# Altium project Wireless_Security_Detector.PrjPcb (part 1 of 2)
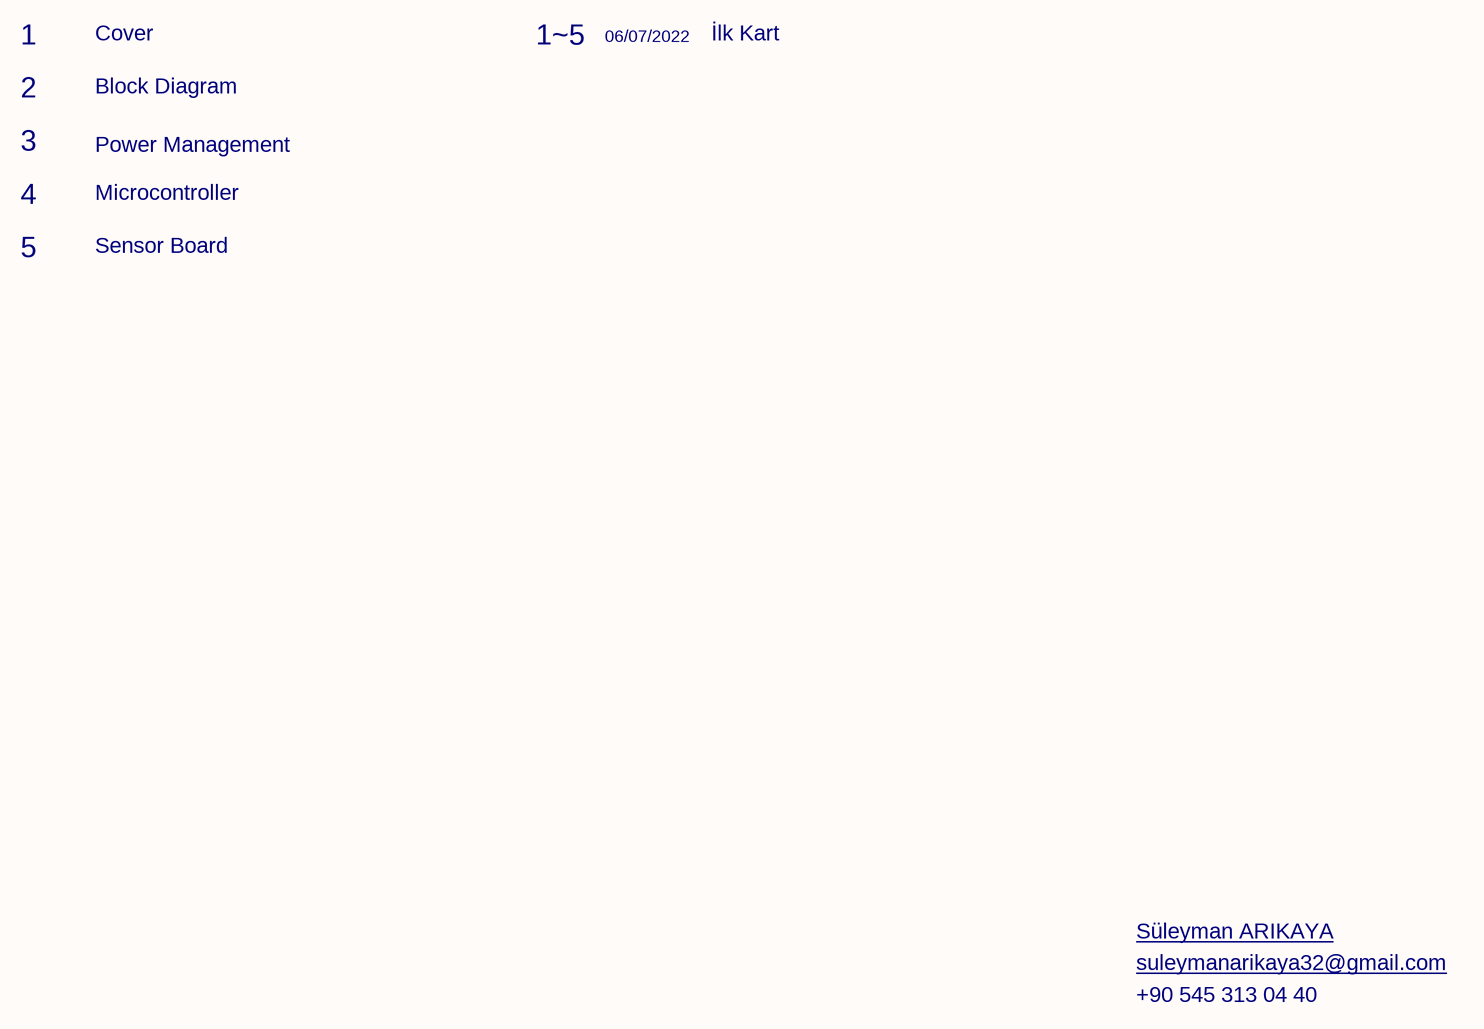
[diagram p0: Cover.SchDoc]
4 sheets, 85 parts. Net scope: flat (ports and power ports of the same name join across sheets).
Board file: Wireless_Detector.PcbDoc
Sheets:
  Cover.SchDoc
  Block Diagram.SchDoc
  Microcontroller.SchDoc
  Sensor_Board.SchDoc

## Sheet Cover.SchDoc
size 420 x 297 mm; DrawnBy: Süleyman ARIKAYA; Revision: AA; SheetNumber: 1; SheetTotal: 5

### Notes on the sheet
- 1
- Cover
- Block Diagram
- 1~5
- 06/07/2022
- İlk Kart
- 2
- 3
- Power Management
- 4
- Microcontroller
- 5
- Sensor Board
- Süleyman ARIKAYA <suleymanarikaya32@gmail.com>
- suleymanarikaya32@gmail.com
- +90 545 313 04 40
- İÇİNDEKİLER / CONTEXT
- REVİZYON / REVISION
- ÜRETİM NOTLARI / PRODUCTION NOTES
- Sayfa No
- Page No
- Açıklama / Description
- Tarih
- Date
- Kart Özellikleri
- Boartd Features
- Üretim Çıktıları
- Gerber Files
- Ekler
- Attachments
- İLETİŞİM / CONTACT
- TITLE:
- PROJECT:
- Size:
- A3
- Date:
- Rev:
- Drawn By:
- Süleyman ARIKAYA
- Sheet:
- of

## Sheet Block Diagram.SchDoc
size 420 x 297 mm; DrawnBy: Süleyman ARIKAYA; Revision: AA; SheetNumber: 2; SheetTotal: 5
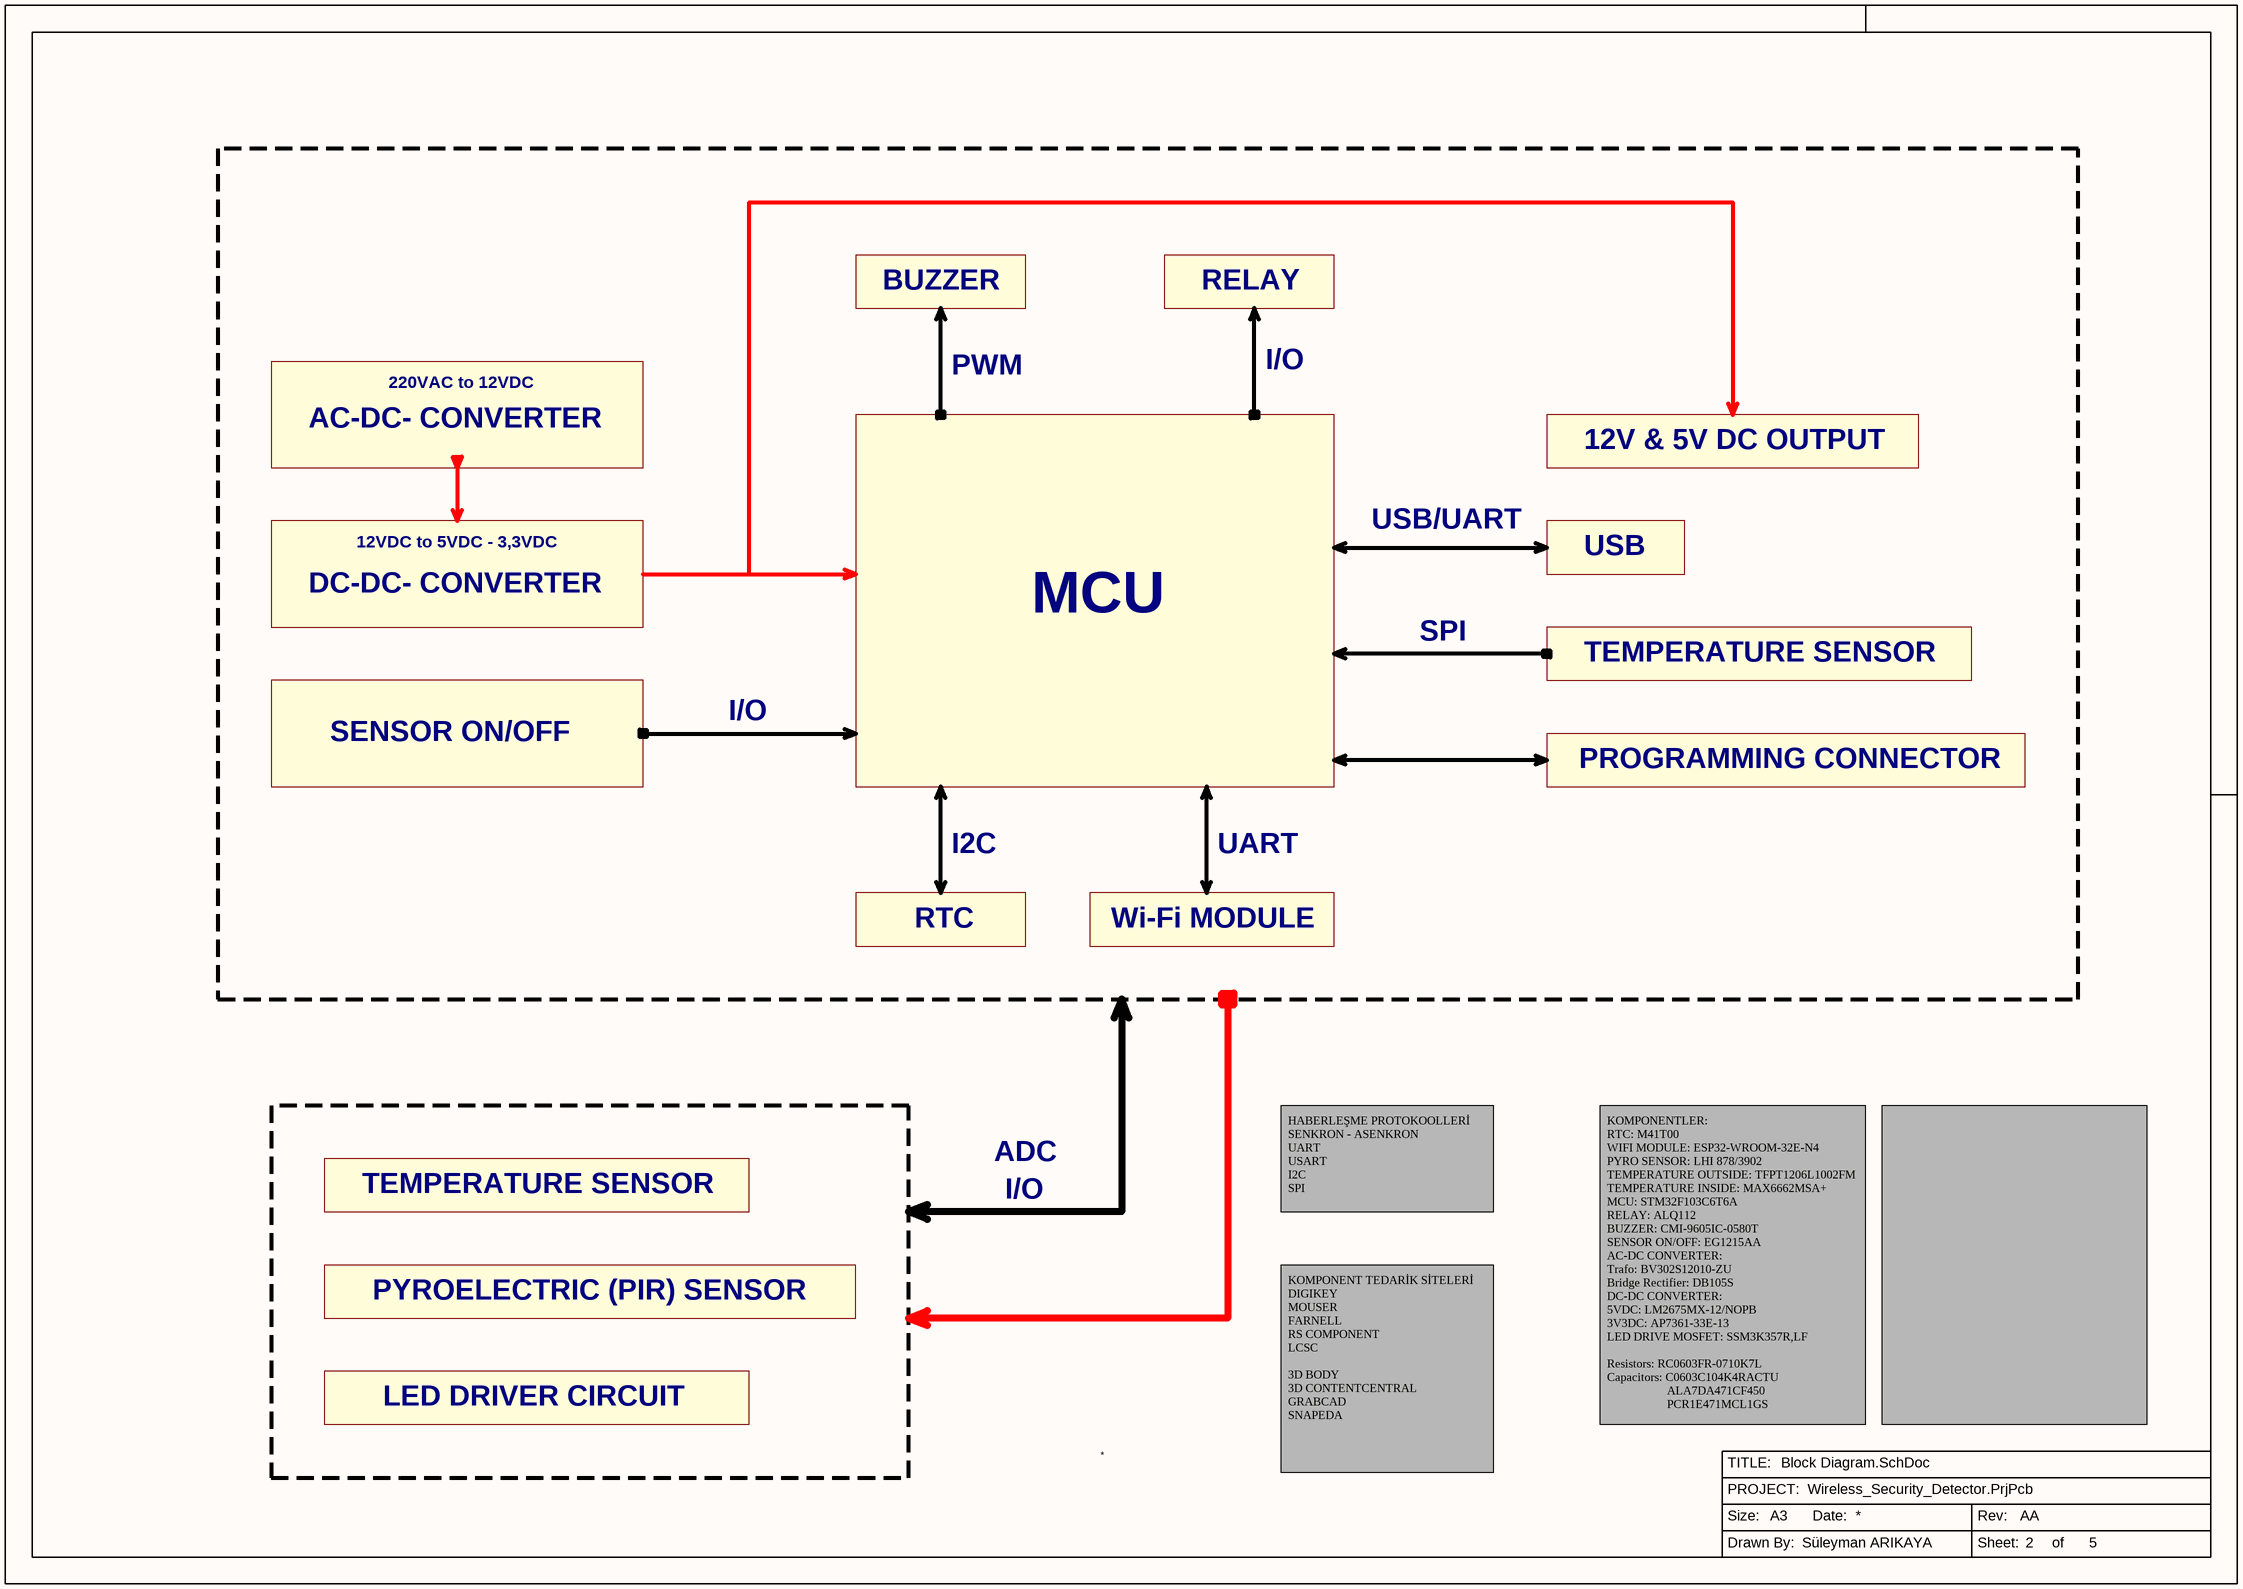
[diagram p1: Block Diagram.SchDoc]

### Notes on the sheet
- BUZZER
- RELAY
- 220VAC to 12VDC
- PWM
- I/O
- AC-DC- CONVERTER
- 12V & 5V DC OUTPUT
- USB/UART
- DC-DC- CONVERTER
- 12VDC to 5VDC - 3,3VDC
- USB
- MCU
- SPI
- TEMPERATURE SENSOR
- SENSOR ON/OFF
- PROGRAMMING CONNECTOR
- I2C
- UART
- RTC
- Wi-Fi MODULE
- ADC
- HABERLEŞME PROTOKOOLLERİ
  SENKRON - ASENKRON
  UART
  USART
  I2C
  SPI
- PYROELECTRIC (PIR) SENSOR
- LED DRIVER CIRCUIT
- KOMPONENT TEDARİK SİTELERİ
  DIGIKEY
  MOUSER
  FARNELL
  RS COMPONENT
  LCSC
  3D BODY
  3D CONTENTCENTRAL
  GRABCAD
  SNAPEDA
- KOMPONENTLER:
  RTC: M41T00
  WIFI MODULE: ESP32-WROOM-32E-N4
  PYRO SENSOR: LHI 878/3902
  TEMPERATURE OUTSIDE: TFPT1206L1002FM
  TEMPERATURE INSIDE: MAX6662MSA+
  MCU: STM32F103C6T6A
  RELAY: ALQ112
  BUZZER: CMI-9605IC-0580T
  SENSOR ON/OFF: EG1215AA
  AC-DC CONVERTER:
  Trafo: BV302S12010-ZU
  Bridge Rectifier: DB105S
  DC-DC CONVERTER:
  5VDC: LM2675MX-12/NOPB
  3V3DC: AP7361-33E-13
  LED DRIVE MOSFET: SSM3K357R,LF
  Resistors: RC0603FR-0710K7L
  Capacitors: C0603C104K4RACTU
  ALA7DA471CF450
  PCR1E471MCL1GS
- TITLE:
- PROJECT:
- Size:
- A3
- Date:
- Rev:
- Drawn By:
- Süleyman ARIKAYA
- Sheet:
- of

## Sheet Microcontroller.SchDoc
size 420 x 297 mm; DrawnBy: Süleyman ARIKAYA; Revision: AA; SheetNumber: 4; SheetTotal: 5
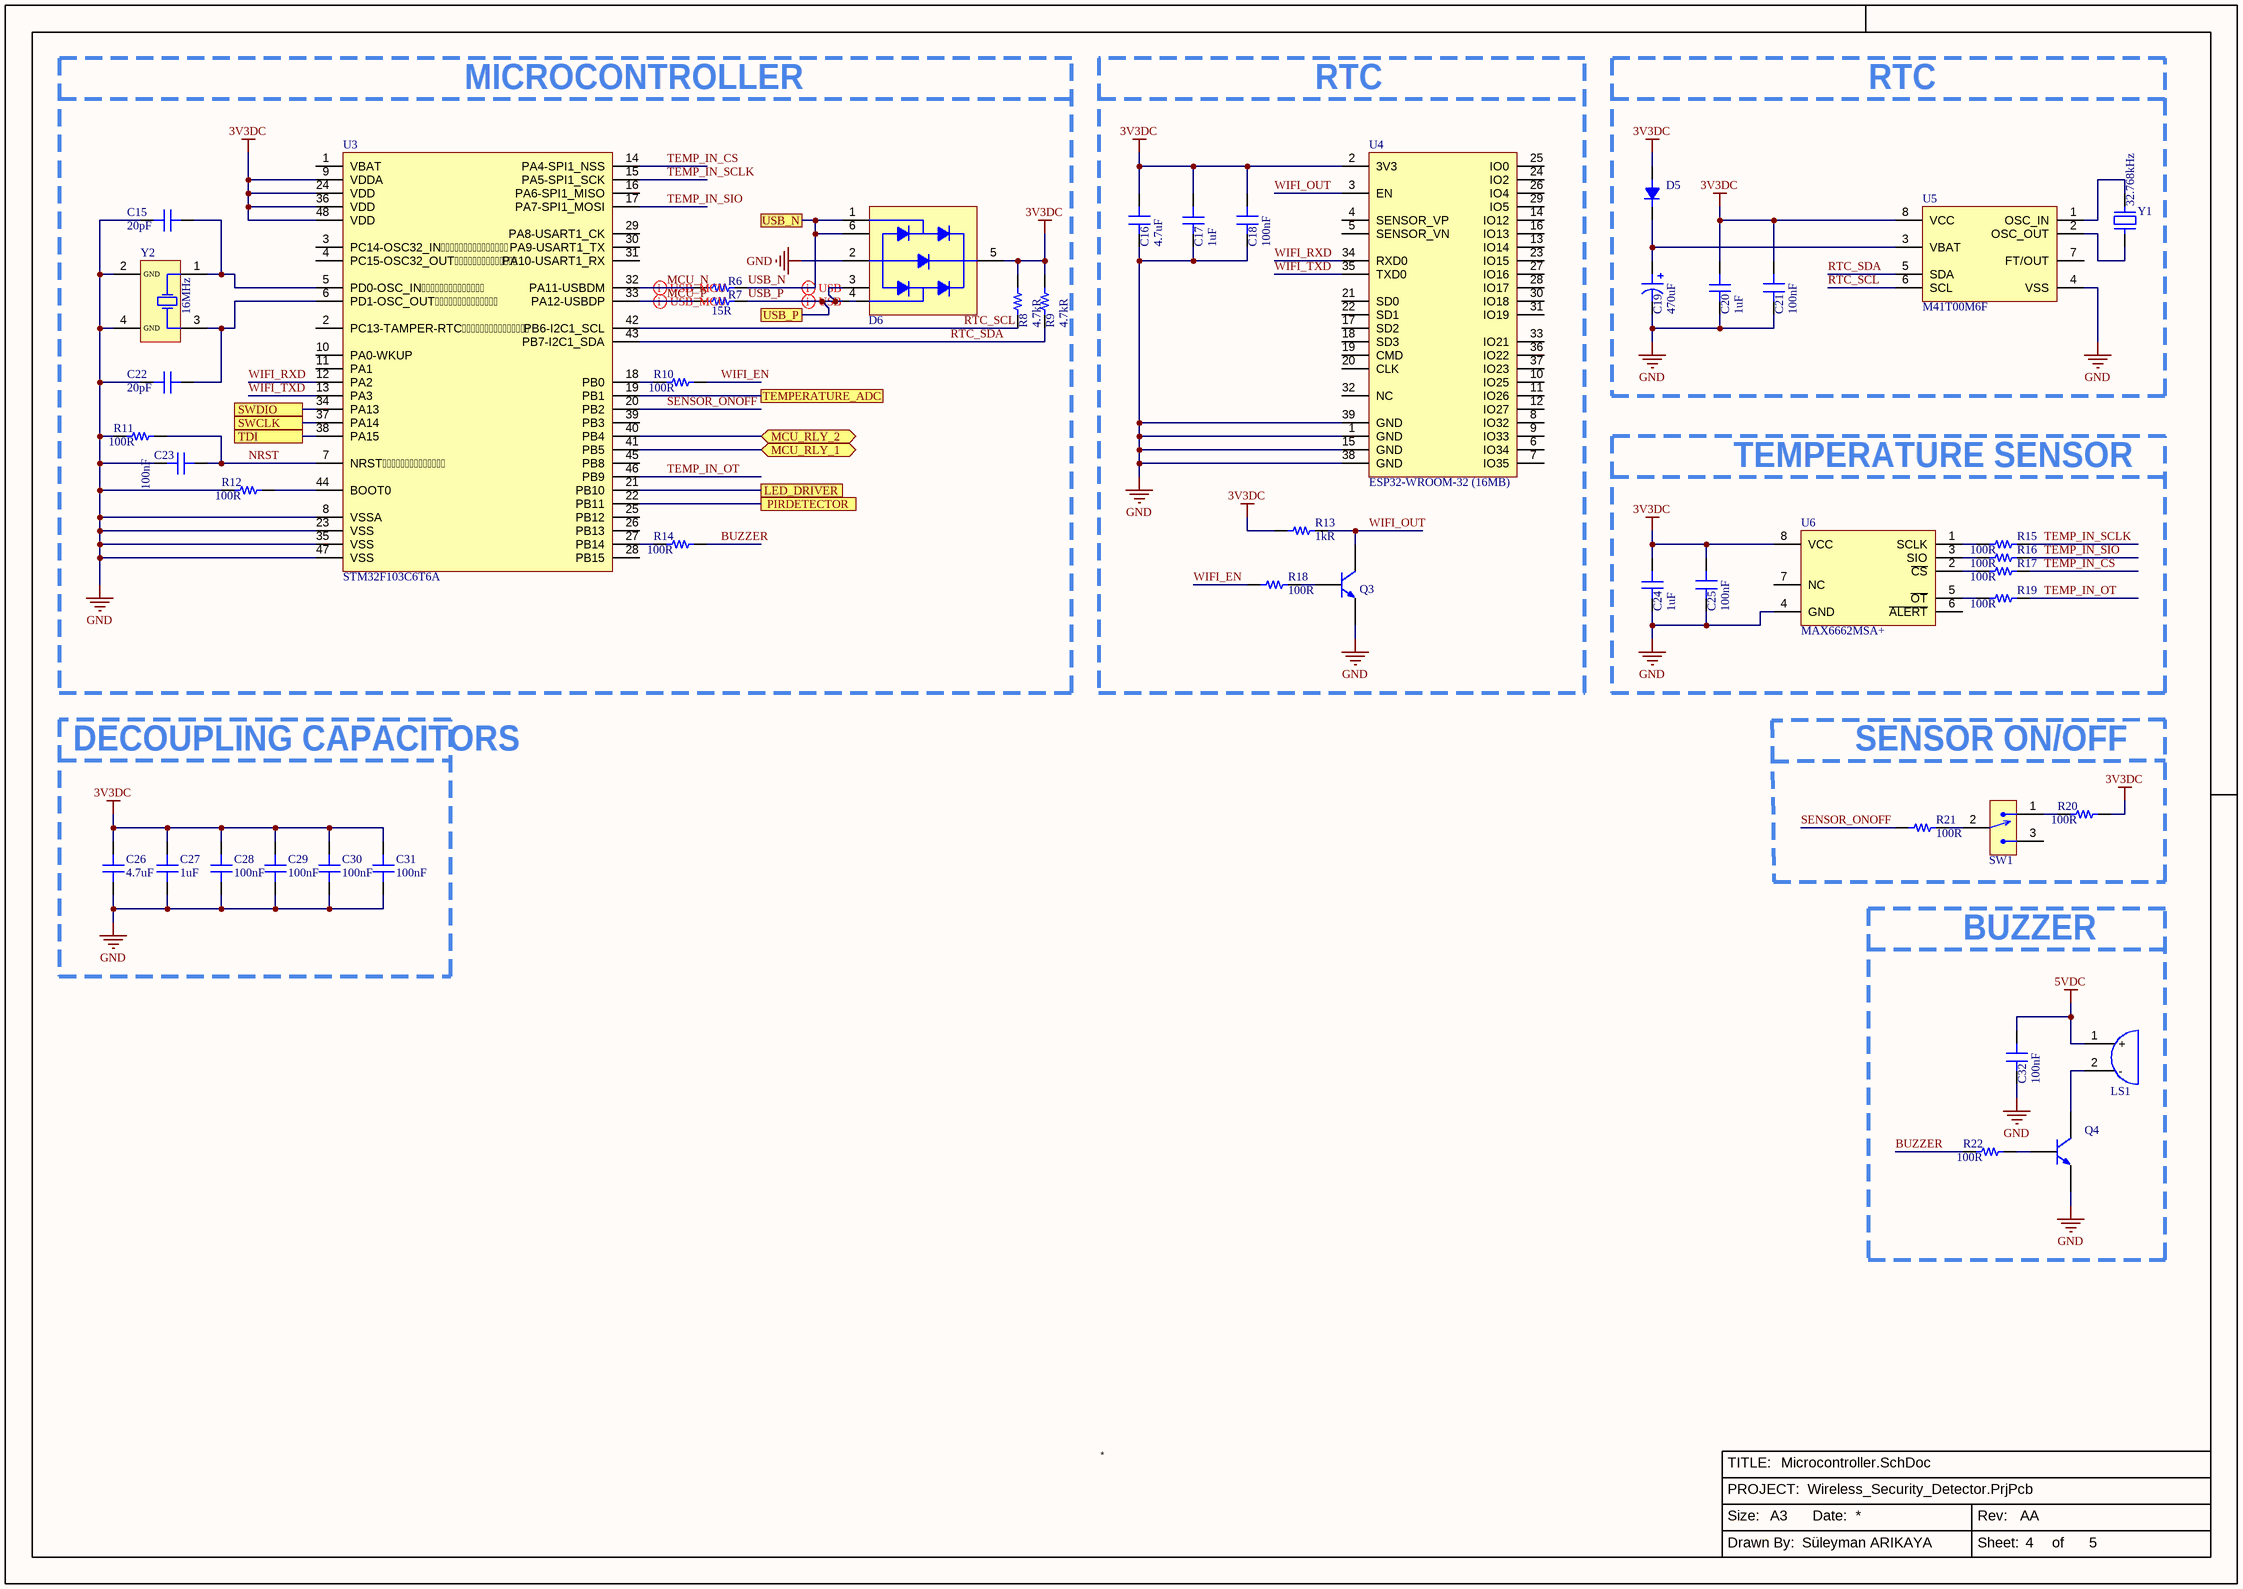
[diagram p2: Microcontroller.SchDoc]

### Parts
C15  Capacitance: 20pF  [C0603_CER]  (hidden comment: CL10C200JB8NNNC)
C16  Capacitance: 4.7uF  [C0805_CER]  (hidden comment: CL21A475KAQNNNE)
C17  Capacitance: 1uF  [C0805_CER]  (hidden comment: CL21B105KBFNNNE)
C18  Capacitance: 100nF  [C0805_CER]  (hidden comment: CL21B104KBCNNNC)
C19  Capacitance: 470uF  [CAP_RADIAL_D10_P5]  (hidden comment: ESH477M050AH4AA)
C20  Capacitance: 1uF  [C0805_CER]  (hidden comment: CL21B105KBFNNNE)
C21  Capacitance: 100nF  [C0805_CER]  (hidden comment: CL21B104KBCNNNC)
C22  Capacitance: 20pF  [C0603_CER]  (hidden comment: CL10C200JB8NNNC)
C23  Capacitance: 100nF  [C0603_CER]  (hidden comment: C0603C104K5RAC7411)
C24  Capacitance: 1uF  [C0805_CER]  (hidden comment: CL21B105KBFNNNE)
C25  Capacitance: 100nF  [C0805_CER]  (hidden comment: CL21B104KBCNNNC)
C26  Capacitance: 4.7uF  [C0805_CER]  (hidden comment: CL21A475KAQNNNE)
C27  Capacitance: 1uF  [C0805_CER]  (hidden comment: CL21B105KBFNNNE)
C28  Capacitance: 100nF  [C0603_CER]  (hidden comment: C0603C104K5RAC7411)
C29  Capacitance: 100nF  [C0603_CER]  (hidden comment: C0603C104K5RAC7411)
C30  Capacitance: 100nF  [C0603_CER]  (hidden comment: C0603C104K5RAC7411)
C31  Capacitance: 100nF  [C0603_CER]  (hidden comment: C0603C104K5RAC7411)
C32  Capacitance: 100nF  [C0805_CER]  (hidden comment: CL21B104KBCNNNC)
D5  1N4148WS  [SOD-323F]  (value not drawn)
D6  USBLC6-2SC6  [SOT23-6L]  (value not drawn)
LS1  CMI-9605IC-0580T  [CMI-9605IC-0580T]  (value not drawn)
Q3  MMBT3904-7-F  [SOT-23F]  (value not drawn)
Q4  MMBT3904-7-F  [SOT-23F]  (value not drawn)
R6  RC0603JR-0715RL  [R0603]  (value not drawn)
R7  Resistance: 15R  [R0603]  (hidden comment: RC0603JR-0715RL)
R8  Resistance: 4.7kR  [R0603]  (hidden comment: RC0603JR-074K7L)
R9  Resistance: 4.7kR  [R0603]  (hidden comment: RC0603JR-074K7L)
R10  Resistance: 100R  [R0603]  (hidden comment: RC0603JR-07100RL)
R11  Resistance: 100R  [R0603]  (hidden comment: RC0603JR-07100RL)
R12  Resistance: 100R  [R0603]  (hidden comment: RC0603JR-07100RL)
R13  Resistance: 1kR  [R0603]  (hidden comment: RC0603FR-071KL)
R14  Resistance: 100R  [R0603]  (hidden comment: RC0603JR-07100RL)
R15  Resistance: 100R  [R0603]  (hidden comment: RC0603JR-07100RL)
R16  Resistance: 100R  [R0603]  (hidden comment: RC0603JR-07100RL)
R17  Resistance: 100R  [R0603]  (hidden comment: RC0603JR-07100RL)
R18  Resistance: 100R  [R0603]  (hidden comment: RC0603JR-07100RL)
R19  Resistance: 100R  [R0603]  (hidden comment: RC0603JR-07100RL)
R20  Resistance: 100R  [R0603]  (hidden comment: RC0603JR-07100RL)
R21  Resistance: 100R  [R0603]  (hidden comment: RC0603JR-07100RL)
R22  Resistance: 100R  [R0603]  (hidden comment: RC0603JR-07100RL)
SW1  EG1215AA  [EG1215AA]  (value not drawn)
U3  STM32F103C6T6A  [LQFP-48]
U4  ESP32-WROOM-32 (16MB)  [ESP32-WROOM-32]
U5  M41T00M6F  [SOIC8]
U6  MAX6662MSA+  [SOIC8]
Y1  Frequency: 32.768kHz  [ABS05]  (hidden comment: ABS05-32.768KHZ-T)
Y2  Frequency: 16MHz  [ECS CRYSTAL 16MHZ]  (hidden comment: ECS-160-20-30B-TR)

### Blocks framed on the sheet
MICROCONTROLLER: C15 C22 C23 D6 R6-R12 R14 U3 Y2
RTC: C16-C18 Q3 R13 R18 U4
RTC: C19-C21 D5 U5 Y1
TEMPERATURE SENSOR: C24 C25 R15-R17 R19 U6
DECOUPLING CAPACITORS: C26-C31
SENSOR ON/OFF: R20 R21 SW1
BUZZER: C32 LS1 Q4 R22

### Ports
LED_DRIVER, MCU_RLY_1 (bidir), MCU_RLY_2 (bidir), PIRDETECTOR, SWCLK, SWDIO, TDI, TEMPERATURE_ADC, USB_N, USB_P

### Nets
3V3DC: C16.2 C17.2 C18.2 C20.2 C21.2 C24.2 C25.2 C26.2 C27.2 C28.2 C29.2 C30.2 C31.2 D5.A D6.5(VBUS) R8.2 R9.1 R13.1 R20.2 U3.9(VDDA) U3.24(VDD) U3.36(VDD) U3.48(VDD) U4.2(3V3) U5.8(VCC) U6.8(VCC)
5VDC: C32.2 LS1.1(+)
GND: C15.1 C16.1 C17.1 C18.1 C19.2 C20.1 C21.1 C22.1 C23.1 C24.1 C25.1 C26.1 C27.1 C28.1 C29.1 C30.1 C31.1 C32.1 D6.2(GND) Q3.2(E) Q4.2(E) R11.1 R12.1 U3.8(VSSA) U3.23(VSS) U3.35(VSS) U3.47(VSS) U4.1(GND) U4.15(GND) U4.38(GND) U4.39(GND) U5.4(VSS) U6.4(GND) Y2.2(GND) Y2.4(GND)
BUZZER: R14.2 R22.1
MCU_N: R6.1 U3.32(PA11-USBDM)
MCU_P: R7.1 U3.33(PA12-USBDP)
NRST: C23.2 R11.2 U3.7(NRST)
RTC_SCL: R8.1 U3.42(PB6-I2C1_SCL) U5.6(SCL)
RTC_SDA: R9.2 U3.43(PB7-I2C1_SDA) U5.5(SDA)
SENSOR_ONOFF: R21.1 U3.20(PB2)
TEMP_IN_CS: R17.2 U3.14(PA4-SPI1_NSS)
TEMP_IN_OT: R19.2 U3.46(PB9)
TEMP_IN_SCLK: R15.2 U3.15(PA5-SPI1_SCK)
TEMP_IN_SIO: R16.2 U3.17(PA7-SPI1_MOSI)
USB_N: D6.1(I/O1) D6.6(I/O1) R6.2 ; port USB_N
USB_P: D6.3(I/O2) D6.4(I/O2) R7.2 ; port USB_P
WIFI_EN: R10.2 R18.1
WIFI_OUT: Q3.3(C) R13.2 U4.3(EN)
WIFI_RXD: U3.12(PA2) U4.34(RXD0)
WIFI_TXD: U3.13(PA3) U4.35(TXD0)
NetC15_2: C15.2 U3.5(PD0-OSC_IN) Y2.1(IN/OUT)
NetC19_1: C19.1 D5.C U5.3(VBAT)
NetC22_2: C22.2 U3.6(PD1-OSC_OUT) Y2.3(OUT/IN)
NetLS1_2: LS1.2(-) Q4.3(C)
NetQ3_1: Q3.1(B) R18.2
NetQ4_1: Q4.1(B) R22.2
NetR10_1: R10.1 U3.18(PB0)
NetR12_2: R12.2 U3.44(BOOT0)
NetR14_1: R14.1 U3.27(PB14)
NetR15_1: R15.1 U6.1(SCLK)
NetR16_1: R16.1 U6.3(SIO)
NetR17_1: R17.1 U6.2(~{CS})
NetR19_1: R19.1 U6.5(~{OT})
NetR20_1: R20.1 SW1.1
NetR21_2: R21.2 SW1.2
NetU3_19: U3.19(PB1) ; port TEMPERATURE_ADC
NetU3_21: U3.21(PB10) ; port LED_DRIVER
NetU3_22: U3.22(PB11) ; port PIRDETECTOR
NetU3_34: U3.34(PA13) ; port SWDIO
NetU3_37: U3.37(PA14) ; port SWCLK
NetU3_38: U3.38(PA15) ; port TDI
NetU3_40: U3.40(PB4) ; port MCU_RLY_2
NetU3_41: U3.41(PB5) ; port MCU_RLY_1
NetU5_1: U5.1(OSC_IN) Y1.2
NetU5_2: U5.2(OSC_OUT) Y1.1

Not connected (* = marked no-connect by the designer): SW1 3; U3 1(VBAT) 2(PC13-TAMPER-RTC) 3(PC14-OSC32_IN) 4(PC15-OSC32_OUT) 10(PA0-WKUP) 11(PA1) 16(PA6-SPI1_MISO) 25(PB12) 26(PB13) 28(PB15) 29(PA8-USART1_CK) 30(PA9-USART1_TX) 31(PA10-USART1_RX) 39(PB3) 45(PB8); U4 4(SENSOR_VP) 5(SENSOR_VN) 6(IO34) 7(IO35) 8(IO32) 9(IO33) 10(IO25) 11(IO26) 12(IO27) 13(IO14) 14(IO12) 16(IO13) 17(SD2) 18(SD3) 19(CMD) 20(CLK) 21(SD0) 22(SD1) 23(IO15) 24(IO2) 25(IO0) 26(IO4) 27(IO16) 28(IO17) 29(IO5) 30(IO18) 31(IO19) 32(NC) 33(IO21) 36(IO22) 37(IO23); U5 7(FT/OUT); U6 6(~{ALERT}) 7(NC)

### Layout directives
differential pair: MCU_N, MCU_P, USB_N, USB_P

### Notes on the sheet
- TITLE:
- PROJECT:
- Size:
- A3
- Date:
- Rev:
- Drawn By:
- Sheet:
- of

### Library data of the parts
C15 C22 = CAP CER 20pF 0603: CAP CER 20pF %5 50V C0G/NP0 0603 SMD; Manufacturer: Samsung; Designed By: Süleyman ARIKAYA; Tolerance: 5%; Dielectric: C0G; Temperature Coefficient: 300ppm/°C; Supplier 1: Digi-Key; Manufacturer Part Number: CL10C200JB8NNNC; RoHS: Yes; Category: Ceramic Capacitors; Stock 1: 361229; Pricing 1: 1=0.10000, 10=0.04700, 50=0.02580, 100=0.02110, 500=0.01510, 1000=0.01186 (USD); Mount: Surface Mount; Case/Package: 0603; Case Code (Metric): 1608; Case Code (Imperial): 0603; Min Operating Temperature: -55°C; Max Operating Temperature: 125°C; Package Quantity: 1; Packaging: Tape and Reel; Voltage Rating: 50V; Voltage: 50V; Series: CL; Construction: Flat; Length: 1.6mm; Width: 0.031inch; Height: 0.8mm; Thickness: 0.035inch; Depth: 0.8mm; Radiation Hardening: No; RoHS Compliant: Yes; ComponentLink1URL: https://datasheet.ciiva.com/26877/getdatasheetpartid-640634-26877974.pdf?src-supplier=Verical; ComponentLink1Description: https://datasheet.ciiva.com/26877/getdatasheetpartid-640634-26877974.pdf?src-supplier=Verical; ComponentLink2URL: https://datasheet.ciiva.com/26310/mlcc-catalogdownload2013-eng-26310315.pdf?src-supplier=Distrelec; ComponentLink2Description: https://datasheet.ciiva.com/26310/mlcc-catalogdownload2013-eng-26310315.pdf?src-supplier=Distrelec; Supplier Part Number 1: 1276-1187-1-ND
C16 C26 = CAP CER 4.7uF 0805: CAP CER 4.7uF %10 25V X5R 0805 SMD; Manufacturer: Samsung; Tolerance: 10%; Designed By: Süleyman ARIKAYA; Supplier 1: Digi-Key; Manufacturer Part Number: CL21A475KAQNNNE; RoHS: Yes; Category: Ceramic Capacitors; Stock 1: 5293655; Pricing 1: 1=0.11000, 10=0.08000, 50=0.04520, 100=0.03740, 500=0.02624, 1000=0.02172 (USD); Mount: Surface Mount; Case/Package: 0805; Case Code (Metric): 2012; Case Code (Imperial): 0805; Min Operating Temperature: -55°C; Max Operating Temperature: 85°C; Package Quantity: 1; Packaging: Tape and Reel; Voltage Rating: 25V; Dielectric: X5R; Voltage Rating (DC): 25V; Series: CL; Construction: Flat; Length: 2mm; Width: 0.049inch; Height: 1.25mm; Thickness: 0.055inch; Depth: 1.25mm; Radiation Hardening: No; Lead Free: Lead Free; RoHS Compliant: Yes; ComponentLink1URL: https://datasheet.ciiva.com/25798/cl21a475kaqnnne-25798882.pdf?src-supplier=Digi-Key; ComponentLink1Description: https://datasheet.ciiva.com/25798/cl21a475kaqnnne-25798882.pdf?src-supplier=Digi-Key; Supplier Part Number 1: 1276-1244-1-ND
C17 C20 C24 C27 = CAP CER 1uF 0805: CAP CER 1uF %10 50V X7R 0805 SMD; Manufacturer: Samsung; Designed By: Süleyman ARIKAYA; Tolerance: 10%; Supplier 1: Digi-Key; Manufacturer Part Number: CL21B105KBFNNNE; RoHS: Yes; Category: Ceramic Capacitors; Stock 1: 472080; Pricing 1: 1=0.12000, 10=0.08600, 50=0.04900, 100=0.04060, 500=0.02848, 1000=0.02358 (USD); Mount: Surface Mount; Case/Package: 0805; Case Code (Metric): 2012; Case Code (Imperial): 0805; Min Operating Temperature: -55°C; Max Operating Temperature: 125°C; Packaging: Tape and Reel; Package Quantity: 1; Voltage Rating: 50V; Dielectric: X7R; Voltage: 50V; Series: CL; Construction: Flat; Length: 2mm; Width: 0.049inch; Height: 1.25mm; Thickness: 0.053inch; Depth: 1.25mm; Radiation Hardening: No; RoHS Compliant: Yes; ComponentLink1URL: https://datasheet.ciiva.com/25800/cl21b105kbfnnne-25800291.pdf?src-supplier=Digi-Key; ComponentLink1Description: https://datasheet.ciiva.com/25800/cl21b105kbfnnne-25800291.pdf?src-supplier=Digi-Key; ComponentLink2URL: https://datasheet.ciiva.com/16449/cl21b105kbfnnne-16449003.pdf?src-supplier=Future+Electronics; ComponentLink2Description: https://datasheet.ciiva.com/16449/cl21b105kbfnnne-16449003.pdf?src-supplier=Future+Electronics; ComponentLink3URL: https://datasheet.ciiva.com/26838/getdatasheetpartid-354075-26838668.pdf?src-supplier=Verical; ComponentLink3Description: https://datasheet.ciiva.com/26838/getdatasheetpartid-354075-26838668.pdf?src-supplier=Verical; Supplier Part Number 1: 1276-1029-1-ND
C18 C21 C25 C32 = CAP CER 100nF 0805: CAP CER 100nF %10 50V X7R 0805 SMD; Manufacturer: Samsung; Material: Ceramic; Tolerance: 10%; Designed By: Süleyman ARIKAYA; Supplier 1: Digi-Key; Manufacturer Part Number: CL21B104KBCNNNC; RoHS: Yes; Category: Ceramic Capacitors; Stock 1: 5839564; Pricing 1: 1=0.10000, 10=0.04800, 50=0.02620, 100=0.02140, 500=0.01528, 1000=0.01201 (USD); Mount: Surface Mount; Case/Package: 0805; Case Code (Metric): 2012; Case Code (Imperial): 0805; Contact Plating: Tin; Min Operating Temperature: -55°C; Max Operating Temperature: 125°C; Dielectric: X7R; Packaging: Tape and Reel; Voltage Rating: 50V; Voltage: 50V; Voltage Rating (DC): 50V; Series: CL; Construction: Flat; Length: 2mm; Width: 0.049inch; Height: 0.85mm; Depth: 1.25mm; Thickness: 0.037inch; Radiation Hardening: No; Lead Free: Lead Free; RoHS Compliant: Yes; ComponentLink1URL: https://datasheet.ciiva.com/25710/cl21b104kbcnnnc-25710182.pdf?src-supplier=Digi-Key; ComponentLink1Description: https://datasheet.ciiva.com/25710/cl21b104kbcnnnc-25710182.pdf?src-supplier=Digi-Key; ComponentLink2URL: https://datasheet.ciiva.com/29199/454152-da-01-en-vs-kondensator-0805-29199814.pdf?src-supplier=Conrad; ComponentLink2Description: https://datasheet.ciiva.com/29199/454152-da-01-en-vs-kondensator-0805-29199814.pdf?src-supplier=Conrad; Supplier Part Number 1: 1276-1003-1-ND
C19 = CAP ALU ELEC 470uF 50V: CAP ALUM 470UF 20% 50V RADIAL; Manufacturer: KEMET; Designed By: Süleyman ARIKAYA; Polarity: Polar; Life (Hours): 2000Hour; Supplier 1: Digi-Key; Manufacturer Part Number: ESH477M050AH4AA; RoHS: Yes; Pricing 1: 1=0.73000, 10=0.51800, 50=0.39180, 100=0.34120, 500=0.25276, 1000=0.21485, 2500=0.20222, 5000=0.18958 (USD); Mount: Through Hole; Case/Package: CAP_RADIAL_D10_P5; Min Operating Temperature: -40°C; Max Operating Temperature: 105°C; Packaging: Bulk; Tolerance: 20%; Voltage Rating: 50V; RoHS Compliant: No; ComponentLink1URL: https://api.kemet.com/component-edge/download/datasheet/ESH477M050AH4AA.pdf?src-supplier=Digi-Key; ComponentLink1Description: https://api.kemet.com/component-edge/download/datasheet/ESH477M050AH4AA.pdf?src-supplier=Digi-Key; Supplier Part Number 1: 399-15683-ND
C23 C28-C31 = CAP CER 100nF 0603: CAP CER 100nF %10 50V 0603 SMD; Manufacturer: KEMET; Dielectric Material: Ceramic; Tolerance: 10%; Dielectric: X7R; Dissipation Factor: 2.5%; Designed By: Süleyman ARIKAYA; Supplier 1: Digi-Key; Manufacturer Part Number: C0603C104K5RAC7411; RoHS: Yes; Category: Ceramic Capacitors; Stock 1: 3120000; Pricing 1: 15000=0.01540, 30000=0.01463, 75000=0.01309, 150000=0.01024 (USD); Mount: Surface Mount; Case/Package: 0603; Case Code (Metric): 1608; Case Code (Imperial): 0603; Min Operating Temperature: -55°C; Max Operating Temperature: 125°C; Voltage Rating (DC): 50V; Packaging: Tape and Reel; Package Quantity: 15000; Voltage Rating: 50V; Termination: SMD/SMT; Length: 1.6mm; Width: 0.031inch; Height: 0.8mm; Thickness: 0.035inch; Lead Pitch: 0.7mm; Depth: 0.8mm; Radiation Hardening: No; ComponentLink1URL: https://datasheet.ciiva.com/5424/kem-c1002-x7r-smd-5424426.pdf?src-supplier=Mouser; ComponentLink1Description: https://datasheet.ciiva.com/5424/kem-c1002-x7r-smd-5424426.pdf?src-supplier=Mouser; Supplier Part Number 1: 399-7374-2-ND
D5 = 1N4148WS: Diode Standard 75 V 150mA Surface Mount SOD-323F VR=75V IF=150mA Trr=4ns P=200mW; Manufacturer: ON Semiconductor / Fairchild; Reverse Recovery Time: 4ns; Max Repetitive Reverse Voltage (Vrrm): 75V; Element Configuration: Single; Forward Voltage: 1V; Power Dissipation: 200mW; Max Reverse Current: 5uA; Max Forward Surge Current (Ifsm): 2A; Designed By: Süleyman ARIKAYA; Supplier 1: Digi-Key; Manufacturer Part Number: 1N4148WS; RoHS: Yes; Category: Rectifier Diodes; Stock 1: 2252396; Pricing 1: 1=0.21000, 10=0.19200, 100=0.10460, 500=0.06436, 1000=0.04388 (USD); Mount: Surface Mount; Number of Pins: 2; Contact Plating: Tin,Matte; Weight: 0.0276g; Min Operating Temperature: -55°C; Max Operating Temperature: 150°C; Packaging: Tape and Reel; Forward Current: 150mA; Package Quantity: 1; Average Rectified Current: 150mA; Max Reverse Voltage (DC): 75V; Recovery Time: 4ns; Series: -; Reverse Voltage: 75V; Length: 1.8mm; Width: 1.35mm; Height: 1mm; Radiation Hardening: No; RoHS Compliant: Yes; Lead Free: Lead Free; REACH SVHC: No SVHC; ComponentLink1URL: https://datasheet.ciiva.com/30479/0900766b810e1cd3-30479206.pdf?src-supplier=RSComponents; ComponentLink1Description: https://datasheet.ciiva.com/30479/0900766b810e1cd3-30479206.pdf?src-supplier=RSComponents; ComponentLink2URL: https://datasheet.ciiva.com/15208/getdatasheetpartid-127819-15208358.pdf?src-supplier=Verical; ComponentLink2Description: https://datasheet.ciiva.com/15208/getdatasheetpartid-127819-15208358.pdf?src-supplier=Verical; ComponentLink3URL: https://datasheet.ciiva.com/8300/1n914bws-8300360.pdf?src-supplier=Avnet; ComponentLink3Description: https://datasheet.ciiva.com/8300/1n914bws-8300360.pdf?src-supplier=Avnet; ComponentLink4URL: https://datasheet.ciiva.com/910/1n4148ws-910381.pdf?src-supplier=Digi-Key; ComponentLink4Description: https://datasheet.ciiva.com/910/1n4148ws-910381.pdf?src-supplier=Digi-Key; ComponentLink5URL: https://datasheet.ciiva.com/910/1n4148ws-910382.pdf?src-supplier=Digi-Key; ComponentLink5Description: https://datasheet.ciiva.com/910/1n4148ws-910382.pdf?src-supplier=Digi-Key; ComponentLink6URL: https://datasheet.ciiva.com/910/1n4148ws-910380.pdf?src-supplier=Digi-Key; ComponentLink6Description: https://datasheet.ciiva.com/910/1n4148ws-910380.pdf?src-supplier=Digi-Key; Case/Package: SOD-323F; Supplier Part Number 1: 1N4148WSFSCT-ND
D6 = USB Protection TVS: TVS DIODE 5.25V 17VC SOT23-6L; Manufacturer: STMicroelectronics; Designed By: Süleyman ARIKAYA; Direction: Unidirectional,Bidirectional; Capacitance: 3.5pF; Operating Supply Voltage: 1.1V; Number of Channels: 2; Breakdown Voltage: 6V; Clamping Voltage: 17V; Power Line Protection: Yes; Test Current: 1mA; Max Reverse Leakage Current: 150nA; Peak Pulse Current: 5A; Element Configuration: Dual; Data Rate: 480Mbps; Number of Elements: 1; Working Voltage: 5V; Supplier 1: Digi-Key; Manufacturer Part Number: USBLC6-2SC6; RoHS: Yes; Category: TVS Diodes; Pricing 1: 1=0.63000, 10=0.54200, 100=0.40440, 500=0.31774, 1000=0.24553 (USD); Mount: Surface Mount; Case/Package: SOT23-6L; Number of Pins: 6; Contact Plating: Tin,Matte; Min Operating Temperature: -40°C; Max Operating Temperature: 125°C; Packaging: Tape and Reel; Package Quantity: 3000; Termination: SMD/SMT; Number of Bidirectional Channels: 2; Reverse Standoff Voltage: 5.25V; Min Breakdown Voltage: 6V; ESD Protection: Yes; Leakage Current: 150nA; Series: USB; Reverse Breakdown Voltage: 6V; Polarity: Unidirectional,Bidirectional; Max Breakdown Voltage: 6V; Clamping Voltage-Max: 17V; Length: 3.05mm; Width: 1.75mm; Height: 1.3mm; Depth: 1.75mm; Radiation Hardening: No; REACH SVHC: No SVHC; Lead Free: Lead Free; RoHS Compliant: Yes; ComponentLink1URL: https://datasheet.ciiva.com/1268/1690354-1268384.pdf?src-supplier=Element14; ComponentLink1Description: https://datasheet.ciiva.com/1268/1690354-1268384.pdf?src-supplier=Element14; ComponentLink2URL: https://datasheet.ciiva.com/4508/cd00050750-113117-4508433.pdf?src-supplier=Mouser; ComponentLink2Description: https://datasheet.ciiva.com/4508/cd00050750-113117-4508433.pdf?src-supplier=Mouser; ComponentLink3URL: https://datasheet.ciiva.com/15143/getdatasheetpartid-148465-15143789.pdf?src-supplier=Verical; ComponentLink3Description: https://datasheet.ciiva.com/15143/getdatasheetpartid-148465-15143789.pdf?src-supplier=Verical; ComponentLink4URL: https://datasheet.ciiva.com/16200/cd00050750-16200026.pdf?src-supplier=Future+Electronics; ComponentLink4Description: https://datasheet.ciiva.com/16200/cd00050750-16200026.pdf?src-supplier=Future+Electronics; ComponentLink5URL: https://datasheet.ciiva.com/41444/001184109-da-01-en-ic-esd-protecti-usblc6-2sc6-sot-23-6-stm-41444156.pdf?src-supplier=Conrad; ComponentLink5Description: https://datasheet.ciiva.com/41444/001184109-da-01-en-ic-esd-protecti-usblc6-2sc6-sot-23-6-stm-41444156.pdf?src-supplier=Conrad; Supplier Part Number 1: 497-5235-1-ND
LS1 = CMI-9605IC-0580T: Buzzers Indicator, Internally Driven Magnetic 5 V 30mA 2.7kHz 80dB @ 5V, 10cm Through Hole PC Pins; Manufacturer: CUI; Manufacturer Part Number: CMI-9605-0580T; Designed By: Süleyman ARIKAYA; RoHS: No; ComponentLink1Description: Datasheet; ComponentLink1URL: https://www.cuidevices.com/product/resource/cmi-9605ic-0580t.pdf; Supply Voltage-Nom: 5V; Supplier 1: Digi-Key; Category: Audio Products; Stock 1: 5; Pricing 1: 1=1.43000, 10=1.19000, 25=1.10160, 50=1.03700, 100=0.97450, 500=0.83848, 1000=0.78382, 5000=0.76810 (USD); Supplier Part Number 1: 2223-CMI-9605IC-0580T-ND; Case/Package: CMI-9605IC-0580T
Q3 Q4 = MMBT3904-7-F: NPN Ic=200mA Vceo=40V hfe=100~300 fT=310MHz P=300mW SOT-23; Manufacturer: Diodes Zetex; Max Power Dissipation: 300mW; Collector Emitter Voltage (VCEO): 40V; Max Collector Current: 200mA; Collector Base Voltage (VCBO): 60V; Frequency: 300MHz; hFE Min: 100; Number of Elements: 1; Emitter Base Voltage (VEBO): 6V; Collector Emitter Saturation Voltage: 300mV; Power Dissipation: 350mW; Element Configuration: Single; Designed By: Süleyman ARIKAYA; Supplier 1: Digi-Key; Manufacturer Part Number: MMBT3904-7-F; RoHS: Yes; Category: BJTs; Pricing 1: 1=0.13000, 10=0.11700, 100=0.06370, 500=0.03918, 1000=0.02671 (USD); Mount: Surface Mount; Case/Package: SOT-23F; Number of Pins: 3; Weight: 0.000282oz; Contact Plating: Tin,Matte; Min Operating Temperature: -55°C; Max Operating Temperature: 150°C; Polarity: NPN; Packaging: Tape and Reel; Package Quantity: 3000; Transition Frequency: 300MHz; Collector Emitter Breakdown Voltage: 40V; Max Breakdown Voltage: 40V; Continuous Collector Current: 200mA; Max Frequency: 300MHz; Gain Bandwidth Product: 300MHz; Series: -; Collector-emitter Voltage-Max: 300mV; Voltage Rating (DC): 40V; Length: 3.05mm; Width: 1.4mm; Height: 1mm; Radiation Hardening: No; REACH SVHC: No SVHC; Lead Free: Lead Free; RoHS Compliant: Yes; ComponentLink1URL: https://datasheet.ciiva.com/11201/ds30036-11201778.pdf?src-supplier=Avnet; ComponentLink1Description: https://datasheet.ciiva.com/11201/ds30036-11201778.pdf?src-supplier=Avnet; ComponentLink2URL: https://datasheet.ciiva.com/15138/getdatasheetpartid-53265-15138780.pdf?src-supplier=Verical; ComponentLink2Description: https://datasheet.ciiva.com/15138/getdatasheetpartid-53265-15138780.pdf?src-supplier=Verical; ComponentLink3URL: https://datasheet.ciiva.com/22711/1915516-22711750.pdf?src-supplier=Element14; ComponentLink3Description: https://datasheet.ciiva.com/22711/1915516-22711750.pdf?src-supplier=Element14; ComponentLink4URL: https://datasheet.ciiva.com/11198/ds30036-11198999.pdf?src-supplier=Avnet; ComponentLink4Description: https://datasheet.ciiva.com/11198/ds30036-11198999.pdf?src-supplier=Avnet; ComponentLink5URL: https://datasheet.ciiva.com/6361/ds30036-6361256.pdf?src-supplier=Digi-Key; ComponentLink5Description: https://datasheet.ciiva.com/6361/ds30036-6361256.pdf?src-supplier=Digi-Key; ComponentLink6URL: https://datasheet.ciiva.com/6361/ds30036-6361254.pdf?src-supplier=Digi-Key; ComponentLink6Description: https://datasheet.ciiva.com/6361/ds30036-6361254.pdf?src-supplier=Digi-Key; Supplier Part Number 1: MMBT3904-FDICT-ND
R6 R7 = RES 15 OHM 0603: RES 15 OHM 5% 1/10W 0603; Manufacturer: Yageo; Designed By: Süleyman ARIKAYA; Temperature Coefficient: 100ppm/°C; Voltage Rating (DC): 50V; Power Rating: 100mW; Voltage Rating: 75V; Supplier 1: Digi-Key; Manufacturer Part Number: RC0603JR-0715RL; RoHS: Yes; Category: Chip SMD Resistors; Stock 1: 1082241; Pricing 1: 1=0.10000, 10=0.02000, 100=0.00800, 1000=0.00360, 2500=0.00312 (USD); Case/Package: 0603; Number of Pins: 2; Case Code (Imperial): 0603; Case Code (Metric): 1608; Weight: 7.1E-05oz; Min Operating Temperature: -55°C; Max Operating Temperature: 155°C; Tolerance: 5%; Resistor Type: Thick Film; Packaging: Tape and Reel; Package Quantity: 1; Termination: SMD/SMT; Number of Terminations: 2; Max Power Dissipation: 100mW; Working Voltage: 75V; Features: Moisture Resistant; Series: RC; Resistance Tolerance: 5%; Construction: Rectangular; Length: 1.6mm; Width: 0.8mm; Height: 0.022inch; Depth: 0.8mm; REACH SVHC: No SVHC; Lead Free: Lead Free; Military Standard: Not; RoHS Compliant: Yes; ComponentLink1URL: https://datasheet.ciiva.com/2453/pyu-r-int-thick-7-2453086.pdf?src-supplier=Digi-Key; ComponentLink1Description: https://datasheet.ciiva.com/2453/pyu-r-int-thick-7-2453086.pdf?src-supplier=Digi-Key; ComponentLink2URL: https://datasheet.ciiva.com/2453/pyu-r-int-thick-7-2453087.pdf?src-supplier=Digi-Key; ComponentLink2Description: https://datasheet.ciiva.com/2453/pyu-r-int-thick-7-2453087.pdf?src-supplier=Digi-Key; ComponentLink3URL: https://datasheet.ciiva.com/2453/pyu-r-int-thick-7-2453085.pdf?src-supplier=Digi-Key; ComponentLink3Description: https://datasheet.ciiva.com/2453/pyu-r-int-thick-7-2453085.pdf?src-supplier=Digi-Key; ComponentLink4URL: https://datasheet.ciiva.com/7746/443971-7746446.pdf?src-supplier=Element14; ComponentLink4Description: https://datasheet.ciiva.com/7746/443971-7746446.pdf?src-supplier=Element14; ComponentLink5URL: https://datasheet.ciiva.com/7746/443971-7746445.pdf?src-supplier=Element14; ComponentLink5Description: https://datasheet.ciiva.com/7746/443971-7746445.pdf?src-supplier=Element14; Supplier Part Number 1: 311-15GRDKR-ND
R8 R9 = RES 4.7K OHM 0603: RES 4.7K OHM 5% 1/10W 0603; Manufacturer: Yageo; Voltage Rating (DC): 50V; Temperature Coefficient: 100ppm/°C; Power Rating: 100mW; Designed By: Süleyman ARIKAYA; Supplier 1: Digi-Key; Manufacturer Part Number: RC0603JR-074K7L; RoHS: Yes; Category: Chip SMD Resistors; Stock 1: 7892893; Pricing 1: 1=0.10000, 10=0.02000, 100=0.00800, 1000=0.00360, 2500=0.00312 (USD); Case/Package: 0603; Number of Pins: 2; Case Code (Imperial): 0603; Case Code (Metric): 1608; Size Code: 0603; Min Operating Temperature: -55°C; Max Operating Temperature: 155°C; Resistor Type: Thick Film; Tolerance: 5%; Packaging: Tape and Reel; Voltage Rating: 50V; Termination: SMD/SMT; Features: Moisture Resistant; Max Power Dissipation: 100mW; Number of Terminations: 2; Series: RC; Resistance Tolerance: 5%; Construction: Rectangular; Length: 1.6mm; Width: 0.8mm; Depth: 0.8mm; REACH SVHC: No SVHC; Lead Free: Lead Free; RoHS Compliant: Yes; Military Standard: Not; ComponentLink1URL: https://datasheet.ciiva.com/46412/443971-46412858.pdf?src-supplier=Element14; ComponentLink1Description: https://datasheet.ciiva.com/46412/443971-46412858.pdf?src-supplier=Element14; Supplier Part Number 1: 311-4.7KGRDKR-ND
R10-R12 R14-R22 = RES 100 OHM 0603: RES 100 OHM 5% 1/10W 0603; Manufacturer: Yageo; Temperature Coefficient: 100ppm/°C; Voltage Rating (DC): 50V; Power Rating: 100mW; Designed By: Süleyman ARIKAYA; Supplier 1: Digi-Key; Manufacturer Part Number: RC0603JR-07100RL; RoHS: Yes; Category: Chip SMD Resistors; Stock 1: 3996702; Pricing 1: 5000=0.00258, 10000=0.00224, 25000=0.00197, 50000=0.00180, 125000=0.00177 (USD); Case/Package: 0603; Number of Pins: 2; Contact Plating: Tin,Matte; Case Code (Imperial): 0603; Case Code (Metric): 1608; Size Code: 0603; Min Operating Temperature: -55°C; Max Operating Temperature: 155°C; Tolerance: 5%; Resistor Type: Thick Film; Packaging: Tape and Reel; Voltage Rating: 50V; Termination: SMD/SMT; Features: Moisture Resistant; Series: RC; Max Power Dissipation: 100mW; Number of Terminations: 2; Construction: Rectangular; Resistance Tolerance: 5%; Length: 1.6mm; Width: 0.8mm; Depth: 0.8mm; Radiation Hardening: No; REACH SVHC: Unknown; Lead Free: Lead Free; Military Standard: Not; RoHS Compliant: Yes; ComponentLink1URL: https://datasheet.ciiva.com/7746/443971-7746425.pdf?src-supplier=Element14; ComponentLink1Description: https://datasheet.ciiva.com/7746/443971-7746425.pdf?src-supplier=Element14; ComponentLink2URL: https://datasheet.ciiva.com/7746/443971-7746426.pdf?src-supplier=Element14; ComponentLink2Description: https://datasheet.ciiva.com/7746/443971-7746426.pdf?src-supplier=Element14; ComponentLink3URL: https://datasheet.ciiva.com/8883/pyu-rc0603-51-rohs-l-4-8883047.pdf?src-supplier=Avnet; ComponentLink3Description: https://datasheet.ciiva.com/8883/pyu-rc0603-51-rohs-l-4-8883047.pdf?src-supplier=Avnet; ComponentLink4URL: https://datasheet.ciiva.com/15189/getdatasheetpartid-325207-15189846.pdf?src-supplier=Verical; ComponentLink4Description: https://datasheet.ciiva.com/15189/getdatasheetpartid-325207-15189846.pdf?src-supplier=Verical; Supplier Part Number 1: 311-100GRTR-ND
R13 = RES 1K OHM 0603: RES SMD 1K OHM 1% 1/10W 0603; Manufacturer: Yageo; Temperature Coefficient: 100ppm/°C; Voltage Rating (DC): 50V; Power Rating: 100mW; Voltage Rating: 75V; Designed By: Süleyman ARIKAYA; Supplier 1: Digi-Key; Manufacturer Part Number: RC0603FR-071KL; RoHS: Yes; Category: Chip SMD Resistors; Stock 1: 58110067; Pricing 1: 1=0.10000, 10=0.02400, 100=0.00970, 1000=0.00436, 2500=0.00378 (USD); Case/Package: 0603; Number of Pins: 2; Case Code (Imperial): 0603; Case Code (Metric): 1608; Weight: 7.1E-05oz; Size Code: 0603; Min Operating Temperature: -55°C; Max Operating Temperature: 155°C; Tolerance: 1%; Resistor Type: Thick Film; Packaging: Tape and Reel; Termination: SMD/SMT; Features: Moisture Resistant; Series: RC; Max Power Dissipation: 100mW; Number of Terminations: 2; Resistance Tolerance: 1%; Construction: Rectangular; Length: 1.6mm; Width: 0.8mm; Height: 0.45mm; Depth: 0.8mm; Lead Pitch: 0.3mm; REACH SVHC: Unknown; Lead Free: Lead Free; Military Standard: Not; RoHS Compliant: Yes; ComponentLink1URL: https://datasheet.ciiva.com/7660/38590-7660789.pdf?src-supplier=Element14; ComponentLink1Description: https://datasheet.ciiva.com/7660/38590-7660789.pdf?src-supplier=Element14; ComponentLink2URL: https://datasheet.ciiva.com/7983/443971-7983596.pdf?src-supplier=Element14; ComponentLink2Description: https://datasheet.ciiva.com/7983/443971-7983596.pdf?src-supplier=Element14; ComponentLink3URL: https://datasheet.ciiva.com/22747/443971-22747519.pdf?src-supplier=Element14; ComponentLink3Description: https://datasheet.ciiva.com/22747/443971-22747519.pdf?src-supplier=Element14; ComponentLink4URL: https://datasheet.ciiva.com/46440/1868787-46440891.pdf?src-supplier=Element14; ComponentLink4Description: https://datasheet.ciiva.com/46440/1868787-46440891.pdf?src-supplier=Element14; ComponentLink5URL: https://datasheet.ciiva.com/7746/1738695-7746239.pdf?src-supplier=Element14; ComponentLink5Description: https://datasheet.ciiva.com/7746/1738695-7746239.pdf?src-supplier=Element14; ComponentLink6URL: https://datasheet.ciiva.com/15189/getdatasheetpartid-409289-15189591.pdf?src-supplier=Verical; ComponentLink6Description: https://datasheet.ciiva.com/15189/getdatasheetpartid-409289-15189591.pdf?src-supplier=Verical; Supplier Part Number 1: 311-10.0KHRCT-ND
SW1 = EG1215AA: Slide Switch, SPDT, 0.025A, 24V, SMD; Manufacturer: E-Switch; Mechanical Life: 10000Cycles; Switch Function: On-On; Current Rating: 25mA; Actuator Type: Standard; Switch Travel: 1.5mm; Operating Force: 150gf; Zener Voltage: 9.1V; Tolerance: 4.95%; Max Power Dissipation: 5W; Impedance: 2R; Actuator Length: 1.4mm; Designed By: Süleyman ARIKAYA; Supplier 1: Digi-Key; Manufacturer Part Number: EG1215AA; RoHS: Yes; Stock 1: 16131; Pricing 1: 1=0.99000, 10=0.95100, 25=0.88840, 100=0.77150, 250=0.70200, 500=0.65080, 1000=0.60327 (USD); Mount: Surface Mount,Through Hole; Case/Package: Axial - EG1215AA; Min Operating Temperature: -20°C; Max Operating Temperature: 175°C; Throw Configuration: SPDT; Packaging: Cut Tape; Voltage Rating (DC): 24V; Termination: Gull Wing; Electrical Life: 10000Cycles; ComponentLink1URL: https://media.digikey.com/pdf/Data%20Sheets/E-Switch%20PDFs/EG1215_Series_Ds.pdf?src-supplier=Digi-Key; ComponentLink1Description: https://media.digikey.com/pdf/Data%20Sheets/E-Switch%20PDFs/EG1215_Series_Ds.pdf?src-supplier=Digi-Key; ComponentLink2URL: http://www.farnell.com/datasheets/2645007.pdf?src-supplier=Farnell; ComponentLink2Description: http://www.farnell.com/datasheets/2645007.pdf?src-supplier=Farnell; Supplier Part Number 1: EG5720CT-ND
U3 = STM32F103C6T6A: MCU 32-bit STM32F ARM Cortex M3 RISC 32KB Flash 2.5V/3.3V 48-Pin LQFP Tray; Manufacturer: STMicroelectronics; Number of Timers/Counters: 3; Max Supply Voltage: 3.6V; Frequency: 72MHz; Interface: I2C,SPI,USART; RAM Size: 10KB; Max Power Dissipation: 363mW; Number of I/Os: 37; Min Supply Voltage: 2V; Oscillator Type: Internal; Data Bus Width: 32b; Watchdog Timer: Yes; Peripherals: POR,PWM,WDT,DMA,Temp Sensor,I2C; Number of ADC Channels: 10; Number of SPI Channels: 1; Designed By: Süleyman ARIKAYA; Manufacturer Part Number: STM32F103C6T6A; RoHS: Yes; Category: Microcontrollers; Pricing 1: 1=7.21000, 10=6.47900, 25=6.12520, 80=5.30850, 250=5.03628, 500=4.53720 (USD); Case/Package: LQFP; Number of Pins: 48; Weight: 0.006409oz; Min Operating Temperature: -40°C; Max Operating Temperature: 85°C; Package Quantity: 1500; Packaging: Tray; Max Frequency: 72MHz; Number of Programmable I/O: 37; Memory Type: FLASH; Memory Size: 32KB; Core Architecture: ARM; Series: STM32F103C6; Number of I2C Channels: 1; Address Bus Width: 32b; Length: 7mm; Width: 7mm; Height: 1.4mm; Radiation Hardening: No; Lead Free: Lead Free; REACH SVHC: No SVHC; RoHS Compliant: Yes; ComponentLink1URL: https://datasheet.ciiva.com/15122/getdatasheetpartid-69879-15122075.pdf?src-supplier=Verical; ComponentLink1Description: https://datasheet.ciiva.com/15122/getdatasheetpartid-69879-15122075.pdf?src-supplier=Verical; ComponentLink2URL: https://datasheet.ciiva.com/14100/pustm-arm-microcont-stm32f103-en-14100507.pdf?src-supplier=Distrelec; ComponentLink2Description: https://datasheet.ciiva.com/14100/pustm-arm-microcont-stm32f103-en-14100507.pdf?src-supplier=Distrelec; Supplier 1: Digi-Key; Supplier 2: Avnet; Pricing 2: 1500=3.36917, 3000=3.30110, 6000=3.23304, 9000=3.16498, 12000=3.09691, 15000=3.02885, 150000=2.96078 (USD); Supplier Part Number 1: 497-11515-ND; Supplier Part Number 2: STM32F103C6T6A
U4 = ESP32-WROOM-32 (16MB): Bluetooth, WiFi 802.11b/g/n, Bluetooth v4.2 +EDR, Class 1, 2 and 3 Transceiver Module 2.4GHz ~ 2.5GHz Surface Mount; Manufacturer: Espressif Systems; Manufacturer Part Number: ESP32-WROOM-32E(M113EH3200PH3Q0); Designed By: Süleyman ARIKAYA; Supply Voltage-Nom: 3.3V; Data Rate: 150Mbps; Sensitivity: -98dBm; Operating Supply Voltage: 3.6V; RoHS: No; Category: RF Receivers, Transceivers; Stock 1: 47; Pricing 1: 1=4.20000 (USD); ComponentLink1Description: Datasheet; ComponentLink1URL: https://espressif.com/sites/default/files/documentation/esp32_datasheet_en.pdf; Min Operating Temperature: -40; Max Operating Temperature: +85; Mount: Surface Mount; Case/Package: ESP32-WROOM-32 - SMD/SMT; Weight: 0.088185oz; Packaging: Cut Tape; Frequency: 2.5GHz; Package Quantity: 550; ComponentLink2URL: https://datasheet.ciiva.com/70828/esp32-wroom-32-datasheet-en-70828769.pdf?src-supplier=Digi-Key; ComponentLink2Description: https://datasheet.ciiva.com/70828/esp32-wroom-32-datasheet-en-70828769.pdf?src-supplier=Digi-Key; ComponentLink3URL: https://datasheet.ciiva.com/69725/esp32-datasheet-en-69725253.pdf?src-supplier=Digi-Key; ComponentLink3Description: https://datasheet.ciiva.com/69725/esp32-datasheet-en-69725253.pdf?src-supplier=Digi-Key; Supplier 1: Digi-Key; Supplier Part Number 1: 1904-1010-1-ND
U5 = M41T00M6F: Real-time Clocks Clock/Calendar I2C, 2-Wire Serial 70uA @ 2V ~ 5.5V SOIC-8_150mil RoHS; Manufacturer: STMicroelectronics; Designed By: Süleyman ARIKAYA; Non-volatile Memory Size: 8B; Interface: I2C,Serial,2-Wire; Logic Function: Clock; Time Format: HH:MM:SS; Date Format: YY-MM-DD-dd; Supplier 1: Digi-Key; Manufacturer Part Number: M41T00M6F; RoHS: Yes; Category: Memory; Pricing 1: 1=3.96000, 10=3.55600, 25=3.36160, 100=2.91340, 250=2.76404, 500=2.48016, 1000=2.46662 (USD); Mount: Surface Mount; Case/Package: SOIC; Number of Pins: 8; Weight: 0.019048oz; Min Operating Temperature: -40°C; Max Operating Temperature: 85°C; Max Supply Voltage: 5.5V; Min Supply Voltage: 2V; Packaging: Tape and Reel; Package Quantity: 2500; Memory Size: 8B; RAM Size: 8B; Series: M41T00; Supply Voltage-Nom: 5.5V; Length: 5mm; Width: 4mm; Height: 1.5mm; Radiation Hardening: No; REACH SVHC: No SVHC; Lead Free: Lead Free; Temperature Grade: INDUSTRIAL; RoHS Compliant: Yes; ComponentLink1URL: https://datasheet.ciiva.com/16213/cd00001542-16213654.pdf?src-supplier=Future+Electronics; ComponentLink1Description: https://datasheet.ciiva.com/16213/cd00001542-16213654.pdf?src-supplier=Future+Electronics; ComponentLink2URL: https://datasheet.ciiva.com/7630/1837112-7630077.pdf?src-supplier=Element14; ComponentLink2Description: https://datasheet.ciiva.com/7630/1837112-7630077.pdf?src-supplier=Element14; ComponentLink3URL: https://datasheet.ciiva.com/41459/001185345-da-01-en-ic-rtc-srl-512kbit-m41t00m6f-soic-8-stm-41459818.pdf?src-supplier=Conrad; ComponentLink3Description: https://datasheet.ciiva.com/41459/001185345-da-01-en-ic-rtc-srl-512kbit-m41t00m6f-soic-8-stm-41459818.pdf?src-supplier=Conrad; Supplier Part Number 1: 497-4697-1-ND
U6 = MAX6662MSA+: Temp Sensor Digital Serial (3-Wire, SPI) 8-Pin SOIC N Tube; Manufacturer: Maxim; Output Type: Digital,SPI; Max Supply Voltage (DC): 5.5V; Min Supply Voltage (DC): 3V; Resolution: 12b; Max Power Dissipation: 471mW; Operating Supply Current: 600uA; Number of Bits: 12; Designed By: Süleyman ARIKAYA; Supplier 1: Digi-Key; Manufacturer Part Number: MAX6662MSA+; RoHS: Yes; Category: Temperature and Humidity Sensors; Case/Package: SOIC8; Number of Pins: 8; Min Operating Temperature: -55°C; Max Operating Temperature: 150°C; Interface: SPI; Packaging: Rail/Tube; Package Quantity: 100; Series: MAX6662; Max Supply Voltage: 5.5V; Min Supply Voltage: 3V; Length: 5mm; Width: 4mm; Height: 1.5mm; Radiation Hardening: No; RoHS Compliant: Yes; Lead Free: Lead Free; REACH SVHC: Unknown; ComponentLink1URL: https://datasheet.ciiva.com/5299/max6662-89142-5299456.pdf?src-supplier=Mouser; ComponentLink1Description: https://datasheet.ciiva.com/5299/max6662-89142-5299456.pdf?src-supplier=Mouser; ComponentLink2URL: https://datasheet.ciiva.com/3277/max6662-3277979.pdf?src-supplier=Avnet; ComponentLink2Description: https://datasheet.ciiva.com/3277/max6662-3277979.pdf?src-supplier=Avnet; ComponentLink3URL: https://datasheet.ciiva.com/2003/max6662-2003390.pdf?src-supplier=Digi-Key; ComponentLink3Description: https://datasheet.ciiva.com/2003/max6662-2003390.pdf?src-supplier=Digi-Key; Supplier Part Number 1: MAX6662MSA+-ND
Y1 = CRYSTAL 32768kHz: CRYSTAL 32.7680KHZ 12.5PF SMD; Manufacturer: Abracon; Designed By: Süleyman ARIKAYA; Frequency Tolerance: 20ppm; ESR (Equivalent Series Resistance): 90kR; Supplier 1: Digi-Key; Manufacturer Part Number: ABS05-32.768KHZ-T; RoHS: Yes; Category: Crystals; Stock 1: 435809; Pricing 1: 1=1.47000, 10=1.40400, 50=1.37080, 100=1.17500, 500=1.14240, 1000=0.96288 (USD); Mount: Surface Mount; Case/Package: ABS05-32.768KHZ-T; Number of Pins: 2; Min Operating Temperature: -40°C; Max Operating Temperature: 85°C; Packaging: Tape and Reel; Load Capacitance: 12.5pF; Package Quantity: 3000; Tolerance: 20ppm; Termination: SMD/SMT; Series Resistance: 90kR; Series: ABS05; Operating Frequency: 32.768 kHz; Length: 1.6mm; Width: 0.039inch; Height: 0.02inch; Depth: 1mm; Radiation Hardening: No; REACH SVHC: No SVHC; Lead Free: Lead Free; RoHS Compliant: Yes; ComponentLink1URL: https://datasheet.ciiva.com/23810/abs05-23810480.pdf?src-supplier=Newark; ComponentLink1Description: https://datasheet.ciiva.com/23810/abs05-23810480.pdf?src-supplier=Newark; ComponentLink2URL: https://datasheet.ciiva.com/6728/abs05-6728949.pdf?src-supplier=Digi-Key; ComponentLink2Description: https://datasheet.ciiva.com/6728/abs05-6728949.pdf?src-supplier=Digi-Key; ComponentLink3URL: https://datasheet.ciiva.com/6728/abs05-6728950.pdf?src-supplier=Digi-Key; ComponentLink3Description: https://datasheet.ciiva.com/6728/abs05-6728950.pdf?src-supplier=Digi-Key; ComponentLink4URL: https://datasheet.ciiva.com/16411/abs05-16411149.pdf?src-supplier=Future+Electronics; ComponentLink4Description: https://datasheet.ciiva.com/16411/abs05-16411149.pdf?src-supplier=Future+Electronics; Supplier Part Number 1: 535-11899-1-ND
Y2 = CRYSTAL 16MHz 20pF: CRYSTAL 16.0000MHZ 20PF SMD; Manufacturer: ECS International; Frequency Tolerance: 30ppm; ESR (Equivalent Series Resistance): 50R; Frequency Stability: 50ppm; Designed By: Süleyman ARIKAYA; Supplier 1: Digi-Key; Manufacturer Part Number: ECS-160-20-30B-TR; RoHS: Yes; Category: Crystals; Stock 1: 11830; Pricing 1: 1=1.34000, 10=1.28100, 50=1.25140, 100=1.07260, 500=1.04282 (USD); Mount: Surface Mount; Case/Package: ECS CRYSTAL 16MHZ; Min Operating Temperature: -20°C; Max Operating Temperature: 70°C; Package Quantity: 1; Load Capacitance: 20pF; Packaging: Tape and Reel; Tolerance: 50ppm; Termination: SMD/SMT; Series: ECX-53B; Length: 0.197inch; Width: 0.126inch; Height: 0.033inch; Lead Free: Lead Free; RoHS Compliant: Yes; ComponentLink1URL: https://datasheet.ciiva.com/853/ecx-53b-853408.pdf?src-supplier=Digi-Key; ComponentLink1Description: https://datasheet.ciiva.com/853/ecx-53b-853408.pdf?src-supplier=Digi-Key; ComponentLink2URL: https://datasheet.ciiva.com/853/ecx-53b-853407.pdf?src-supplier=Digi-Key; ComponentLink2Description: https://datasheet.ciiva.com/853/ecx-53b-853407.pdf?src-supplier=Digi-Key; ComponentLink3URL: https://datasheet.ciiva.com/853/ecx-53b-853406.pdf?src-supplier=Digi-Key; ComponentLink3Description: https://datasheet.ciiva.com/853/ecx-53b-853406.pdf?src-supplier=Digi-Key; Supplier Part Number 1: XC1120CT-ND